# Altium schematic sheet I2C_Devices.SchDoc
size A4; SheetNumber: 4; SheetTotal: 8
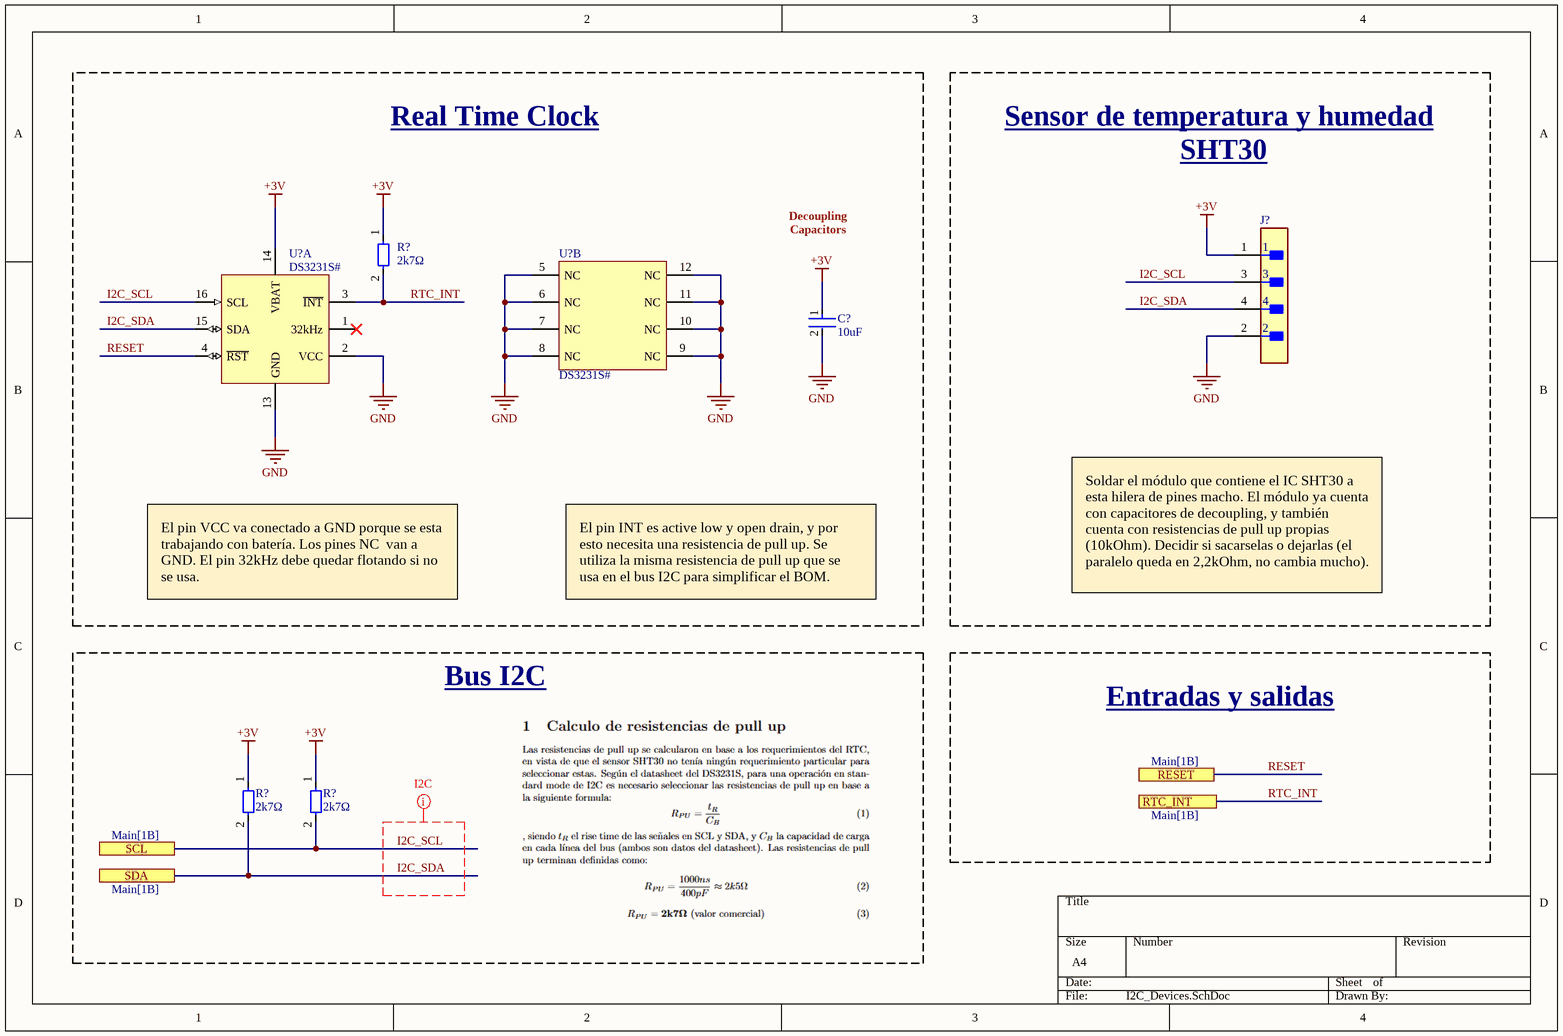
[diagram p0: I2C_Devices.SchDoc]

## Parts
(Parts that share a designator on the sheet are numbered #1, #2 ... from top to bottom, then left to right.)
C?  Capacitance: 10uF  [FP-CL21-IPC_B]  (hidden comment: CL21A106KPFNNNE)
J?  HTSW-104-07-G-S  [FP-HTSW-104-07-G-S-MFG]  (value not drawn)
R?#1  value 2k7Ω  [PACKAGE_0805]  (hidden comment: Simbolo de resistencia genérica)
R?#2  value 2k7Ω  [PACKAGE_0805]  (hidden comment: Simbolo de resistencia genérica)
R?#3  value 2k7Ω  [PACKAGE_0805]  (hidden comment: Simbolo de resistencia genérica)
U?#1  DS3231S#  [W16-H2_M]  (part B of 2)
U?#2  DS3231S#  [W16-H2_M]  (part A of 2)

## Blocks framed on the sheet
Real Time Clock: C? R?#1 U?#1 U?#2
Bus I2C: R?#2 R?#3

## Ports
RESET (see Main[1B]), RTC_INT (see Main[1B]), SCL (see Main[1B]), SDA (see Main[1B])

## Nets
+3V: C?.1 J?.1 R?#1.1 R?#2.1 R?#3.1 U?#2.14(VBAT)
GND: C?.2 J?.2 U?#1.5(NC) U?#1.6(NC) U?#1.7(NC) U?#1.8(NC) U?#1.9(NC) U?#1.10(NC) U?#1.11(NC) U?#1.12(NC) U?#2.2(VCC) U?#2.13(GND)
I2C_SCL: J?.3 R?#3.2 U?#2.16(SCL) ; port SCL
I2C_SDA: J?.4 R?#2.2 U?#2.15(SDA) ; port SDA
RESET: U?#2.4(~{RST}) ; port RESET
RTC_INT: R?#1.2 U?#2.3(~{INT}) ; port RTC_INT

Not connected (* = marked no-connect by the designer): U?#2 1(32kHz)*

## Layout directives
net class I2C: I2C_SCL, I2C_SDA

## Notes on the sheet
- Sensor de temperatura y humedad
- SHT30
- Decoupling
  Capacitors
- El pin VCC va conectado a GND porque se esta trabajando con batería. Los pines NC  van a GND. El pin 32kHz debe quedar flotando si no se usa.
- El pin INT es active low y open drain, y por esto necesita una resistencia de pull up. Se utiliza la misma resistencia de pull up que se usa en el bus I2C para simplificar el BOM.
- Soldar el módulo que contiene el IC SHT30 a esta hilera de pines macho. El módulo ya cuenta con capacitores de decoupling, y también cuenta con resistencias de pull up propias (10kOhm). Decidir si sacarselas o dejarlas (el paralelo queda en 2,2kOhm, no cambia mucho).
- Entradas y salidas

## Library data of the parts
C? = CMP-2000-06103-2: CL21 Series 0805 10uF 10V ±10% Tolerance X5R Multilayer Ceramic Chip Capacitor; Case Code (Imperial): 0805; Mount: Surface Mount; Depth: 1.25mm; Length: 2mm; Lead Free: Lead Free; Packaging: Tape and Reel; Dielectric: X5R; Width: 0.049inch; Package Quantity: 1; Height: 1.25mm; Case/Package: 0805; Voltage Rating: 10V; Thickness: 0.053inch; Max Operating Temperature: 85°C; Tolerance: 10%; Case Code (Metric): 2012; Contact Plating: Tin; Min Operating Temperature: -55°C; Radiation Hardening: No; Voltage Rating (DC): 10V
J? = CMP-02766-001776-1: CONN HEADER VERT 4POS 2.54MM; Gender: Male; Number of Contacts: 4; Packaging: Bulk; RoHS Compliant: Yes; Number of Rows: 1; Mount: Through Hole; Contact Material: Bronze; Series: HTSW; Radiation Hardening: No; Pitch: 2.54mm; Reach SVHC Compliant: Yes; Contact Plating: Gold; Termination: Through Hole
R?#1-R?#3 = Generic R
U?#1 U?#2 = DS3231S# for battery use: IC RTC CLK/CALENDAR I2C 16SOIC. Symbol used with battery as the main supply voltage.